# Altium schematic sheet cw312ttmp91fw_microcontroller.SchDoc: Microcontroller
size Letter; Organization: NewAE Technology Inc.; Address1: 1083 Queen St., Suite 196; Address2: Halifax; Address3: NS; Address4: Canada B3H 0B2; DocumentNumber: .; Revision: .; SheetNumber: 2; SheetTotal: 1; SheetApproved: NO
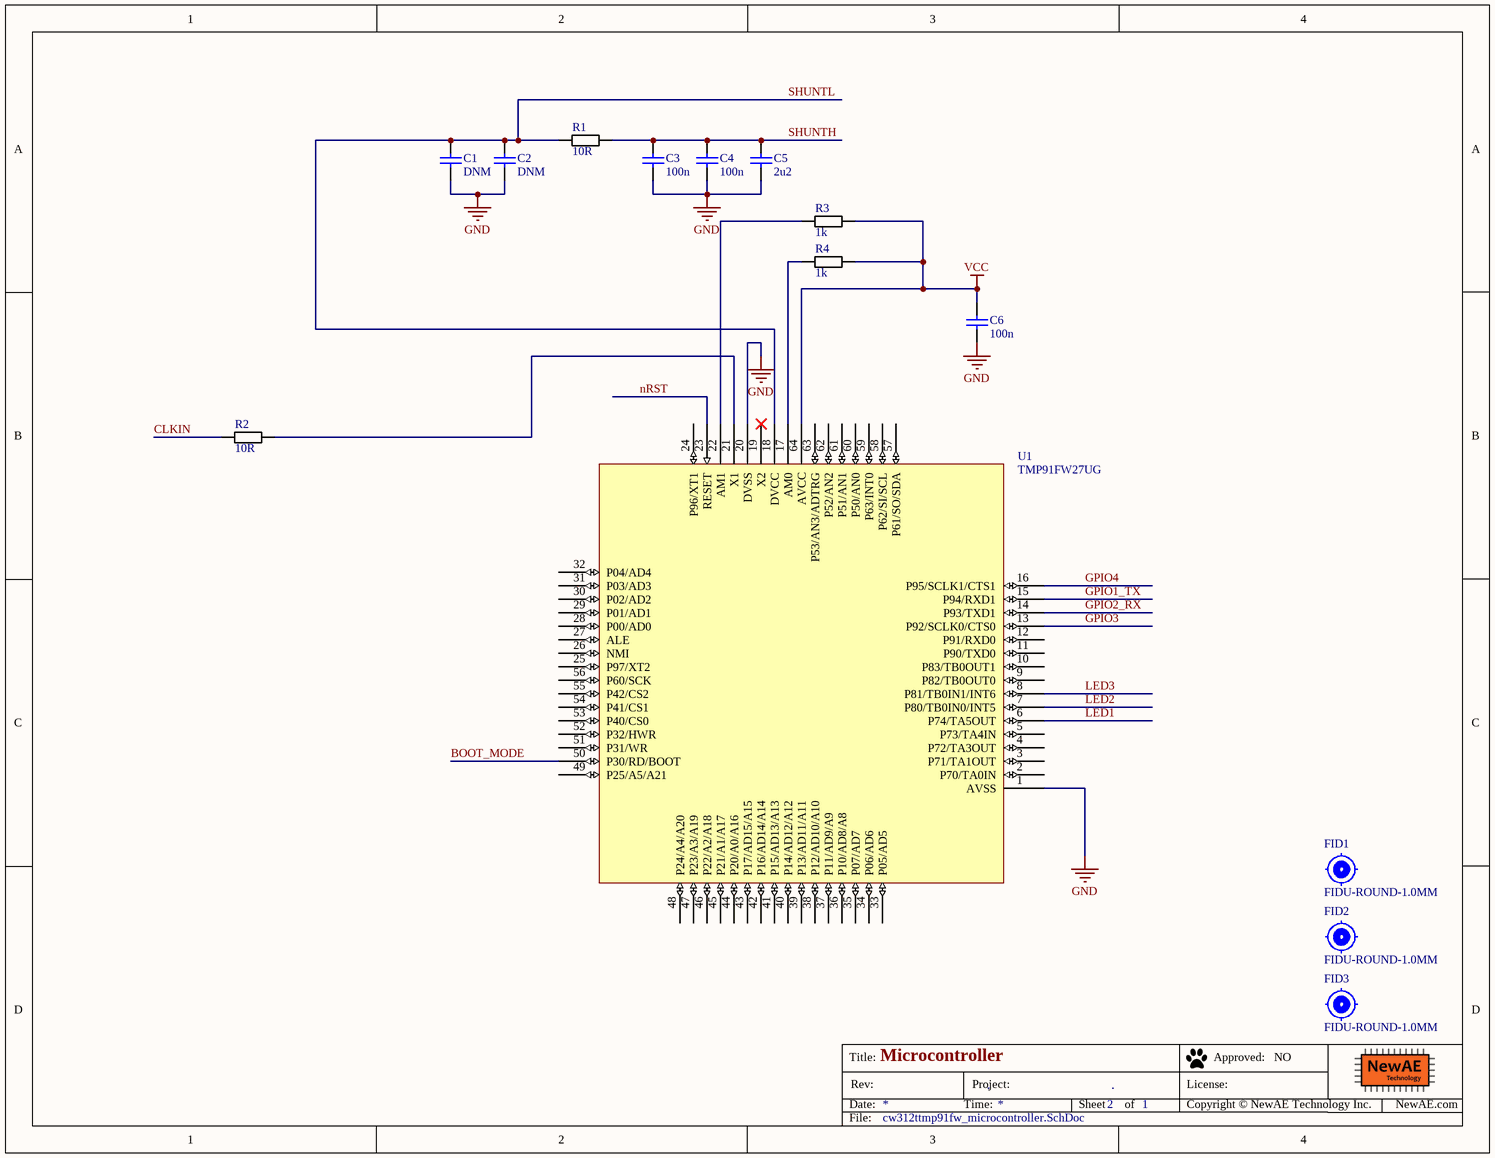
[diagram p0: cw312ttmp91fw_microcontroller.SchDoc]

## Parts
C1  DNM  [CAPC0603_M]
C2  DNM  [CAPC0603_M]
C3  100n  [CAPC0603_M]
C4  100n  [CAPC0603_M]
C5  2u2  [CAPC0603_M]
C6  100n  [CAPC0603_M]
FID1  FIDU-ROUND-1.0MM  [FIDU-ROUND-1.0mm]  (no BOM)
FID2  FIDU-ROUND-1.0MM  [FIDU-ROUND-1.0mm]  (no BOM)
FID3  FIDU-ROUND-1.0MM  [FIDU-ROUND-1.0mm]  (no BOM)
R1  10R  [RESC1608X55N]
R2  10R  [RESC1608X55N]
R3  1k  [RESC1608X55N]
R4  1k  [RESC1608X55N]
U1  TMP91FW27UG  [TQFP50P1200X1200X120-64N]

## Nets
GND: C1.2 C2.2 C3.2 C4.2 C5.2 C6.2 U1.1(AVSS) U1.20(DVSS)
VCC: C6.1 R3.2 R4.2 U1.64(AVCC)
BOOT_MODE: U1.50(P30/RD/BOOT)
CLKIN: R2.1
GPIO1_TX: U1.15(P94/RXD1)
GPIO2_RX: U1.14(P93/TXD1)
GPIO3: U1.13(P92/SCLK0/CTS0)
GPIO4: U1.16(P95/SCLK1/CTS1)
LED1: U1.6(P74/TA5OUT)
LED2: U1.7(P80/TB0IN0/INT5)
LED3: U1.8(P81/TB0IN1/INT6)
nRST: U1.23(RESET)
SHUNTH: C3.1 C4.1 C5.1 R1.2
SHUNTL: C1.1 C2.1 R1.1 U1.18(DVCC)
NetR2_2: R2.2 U1.21(X1)
NetR3_1: R3.1 U1.22(AM1)
NetR4_1: R4.1 U1.17(AM0)

Not connected (* = marked no-connect by the designer): U1 2(P70/TA0IN) 3(P71/TA1OUT) 4(P72/TA3OUT) 5(P73/TA4IN) 9(P82/TB0OUT0) 10(P83/TB0OUT1) 11(P90/TXD0) 12(P91/RXD0) 19(X2)* 24(P96/XT1) 25(P97/XT2) 26(NMI) 27(ALE) 28(P00/AD0) 29(P01/AD1) 30(P02/AD2) 31(P03/AD3) 32(P04/AD4) 33(P05/AD5) 34(P06/AD6) 35(P07/AD7) 36(P10/AD8/A8) 37(P11/AD9/A9) 38(P12/AD10/A10) 39(P13/AD11/A11) 40(P14/AD12/A12) 41(P15/AD13/A13) 42(P16/AD14/A14) 43(P17/AD15/A15) 44(P20/A0/A16) 45(P21/A1/A17) 46(P22/A2/A18) 47(P23/A3/A19) 48(P24/A4/A20) 49(P25/A5/A21) 51(P31/WR) 52(P32/HWR) 53(P40/CS0) 54(P41/CS1) 55(P42/CS2) 56(P60/SCK) 57(P61/SO/SDA) 58(P62/SI/SCL) 59(P63/INT0) 60(P50/AN0) 61(P51/AN1) 62(P52/AN2) 63(P53/AN3/ADTRG)

## Notes on the sheet
- Title:
- Date:
- Rev:
- Time:
- Project:
- Sheet
- of
- License:
- Copyright © NewAE Technology Inc.
- Approved:
- NewAE.com
- File:

## Library data of the parts
C1 C2 = CCHIP-100n-0603: Manufacture 1: Kemet; Manufacture Part Number 1: C0603C104K5RACTU; Component Group: Capacitor; Value: 100n; Case-EIA: 0603; Case-Metric: 1608; Rated Voltage: 50VDC; Part Number: CCHIP-100n-0603; Footprint: 0603; Pin Count: 2; Supplier 1: Digi-Key; Supplier Part Number 1: 399-5089-2-ND; Mounting Technology: SMT; Component Kind: Standard; Component Type: Standard
C3 C4 C6 = CCHIP-100n-0603: 100n, 0603; Manufacture 1: Kemet; Manufacture Part Number 1: C0603C104K5RACTU; Component Group: Capacitor; Case-EIA: 0603; Case-Metric: 1608; Rated Voltage: 50VDC; Part Number: CCHIP-100n-0603; Footprint: 0603; Pin Count: 2; Supplier 1: Digi-Key; Supplier Part Number 1: 399-5089-2-ND; Value: 100n; Mounting Technology: SMT; Component Kind: Standard; Component Type: Standard
C5 = CCHIP-2u2-0603: 2u2, 0603; Manufacture 1: Samsung; Manufacture Part Number 1: CL10B225KP8NNNC; Component Group: Capacitor; Case-EIA: 0603; Case-Metric: 1608; Rated Voltage: 10VDC; Part Number: CCHIP-2u2-0603; Footprint: 0603; Pin Count: 2; Supplier 1: Digi-Key; Supplier Part Number 1: 1276-1134-2-ND; Value: 2u2; Mounting Technology: SMT; Component Kind: Standard; Component Type: Standard
FID1-FID3 = FIDU-ROUND-1.0MM: ROUND FIDUCIAL; Component Group: PCB Feature; Part Number: FIDU-ROUND-1.0MM; Pin Count: 0; Component Type: Standard (No BOM)
R1 R2 = RCHIP-10R-0603: 10R res, 0603, 1%, 1/10W; Manufacture 1: Yageo; Manufacture Part Number 1: RC0603FR-0710RL; Component Group: Resistor; Case-EIA: 0603; Case-Metric: 1608; Rated Power: 0.1W; Rated Voltage: 75VDC; Part Number: RCHIP-10R-0603; Footprint: 0603; Pin Count: 2; Supplier 1: Digi-Key; Supplier Part Number 1: 311-10.0HRCT-ND; Value: 10R; Tolerance: 1%; Mounting Technology: SMT; Temperature Range: -55C to 155C; Component Kind: Standard; Component Type: Standard
R3 R4 = RCHIP-1K-0603: 1k res, 0603, 1%, 1/10W; Manufacture 1: Yageo; Manufacture Part Number 1: RC0603FR-071KL; Component Group: Resistor; Case-EIA: 0603; Case-Metric: 1608; Rated Power: 0.1W; Rated Voltage: 75VDC; Part Number: RCHIP-1K-0603; Footprint: 0603; Pin Count: 2; Supplier 1: Digi-Key; Supplier Part Number 1: 311-1.00KHRCT-ND; Value: 1k; Tolerance: 1%; Mounting Technology: SMT; Temperature Range: -55C to 155C; Component Kind: Standard; Component Type: Standard
U1 = TMP91FW27UG: TMP91FW27, 16-bit micro, LQFP64_0.5; Manufacture 1: Toshiba; Component Group: Digital IC; PP Material Stack: 0; Part Number: TMP91FW27UG; Footprint: TQFP-0.5; Manufacture Part Number 1: TMP91FW27UG; Pin Count: 64; Component Kind: Standard; Component Type: Standard; PP Rotation: 0; PP Rotation1: 0